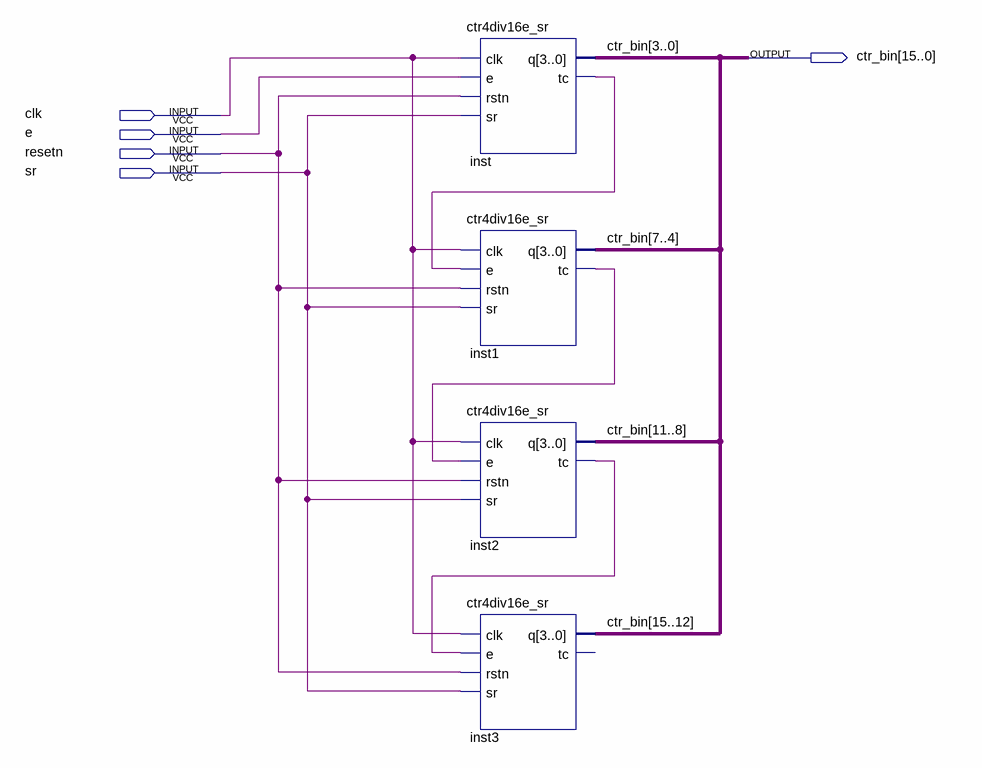
[diagram p0: schematic sheet]
// Quartus schematic ctr16div35536_sr.bdf as structural Verilog: 4 symbols, 5 pins
module ctr16div35536_sr (
  input  clk,
  input  e,
  input  resetn,
  input  sr,
  output [15:0] ctr_bin
);

  wire inst1_tc, inst2_tc, inst_tc;

  ctr4div16e_sr inst (.clk(clk), .e(e), .rstn(resetn), .sr(sr), .q(ctr_bin[3:0]), .tc(inst_tc));
  ctr4div16e_sr inst1 (.clk(clk), .e(inst_tc), .rstn(resetn), .sr(sr), .q(ctr_bin[7:4]), .tc(inst1_tc));
  ctr4div16e_sr inst2 (.clk(clk), .e(inst1_tc), .rstn(resetn), .sr(sr), .q(ctr_bin[11:8]), .tc(inst2_tc));
  ctr4div16e_sr inst3 (.clk(clk), .e(inst2_tc), .rstn(resetn), .sr(sr), .q(ctr_bin[15:12]));  // open: tc
endmodule
